# EAGLE design ai_aerial (EAGLE 6.5.0)
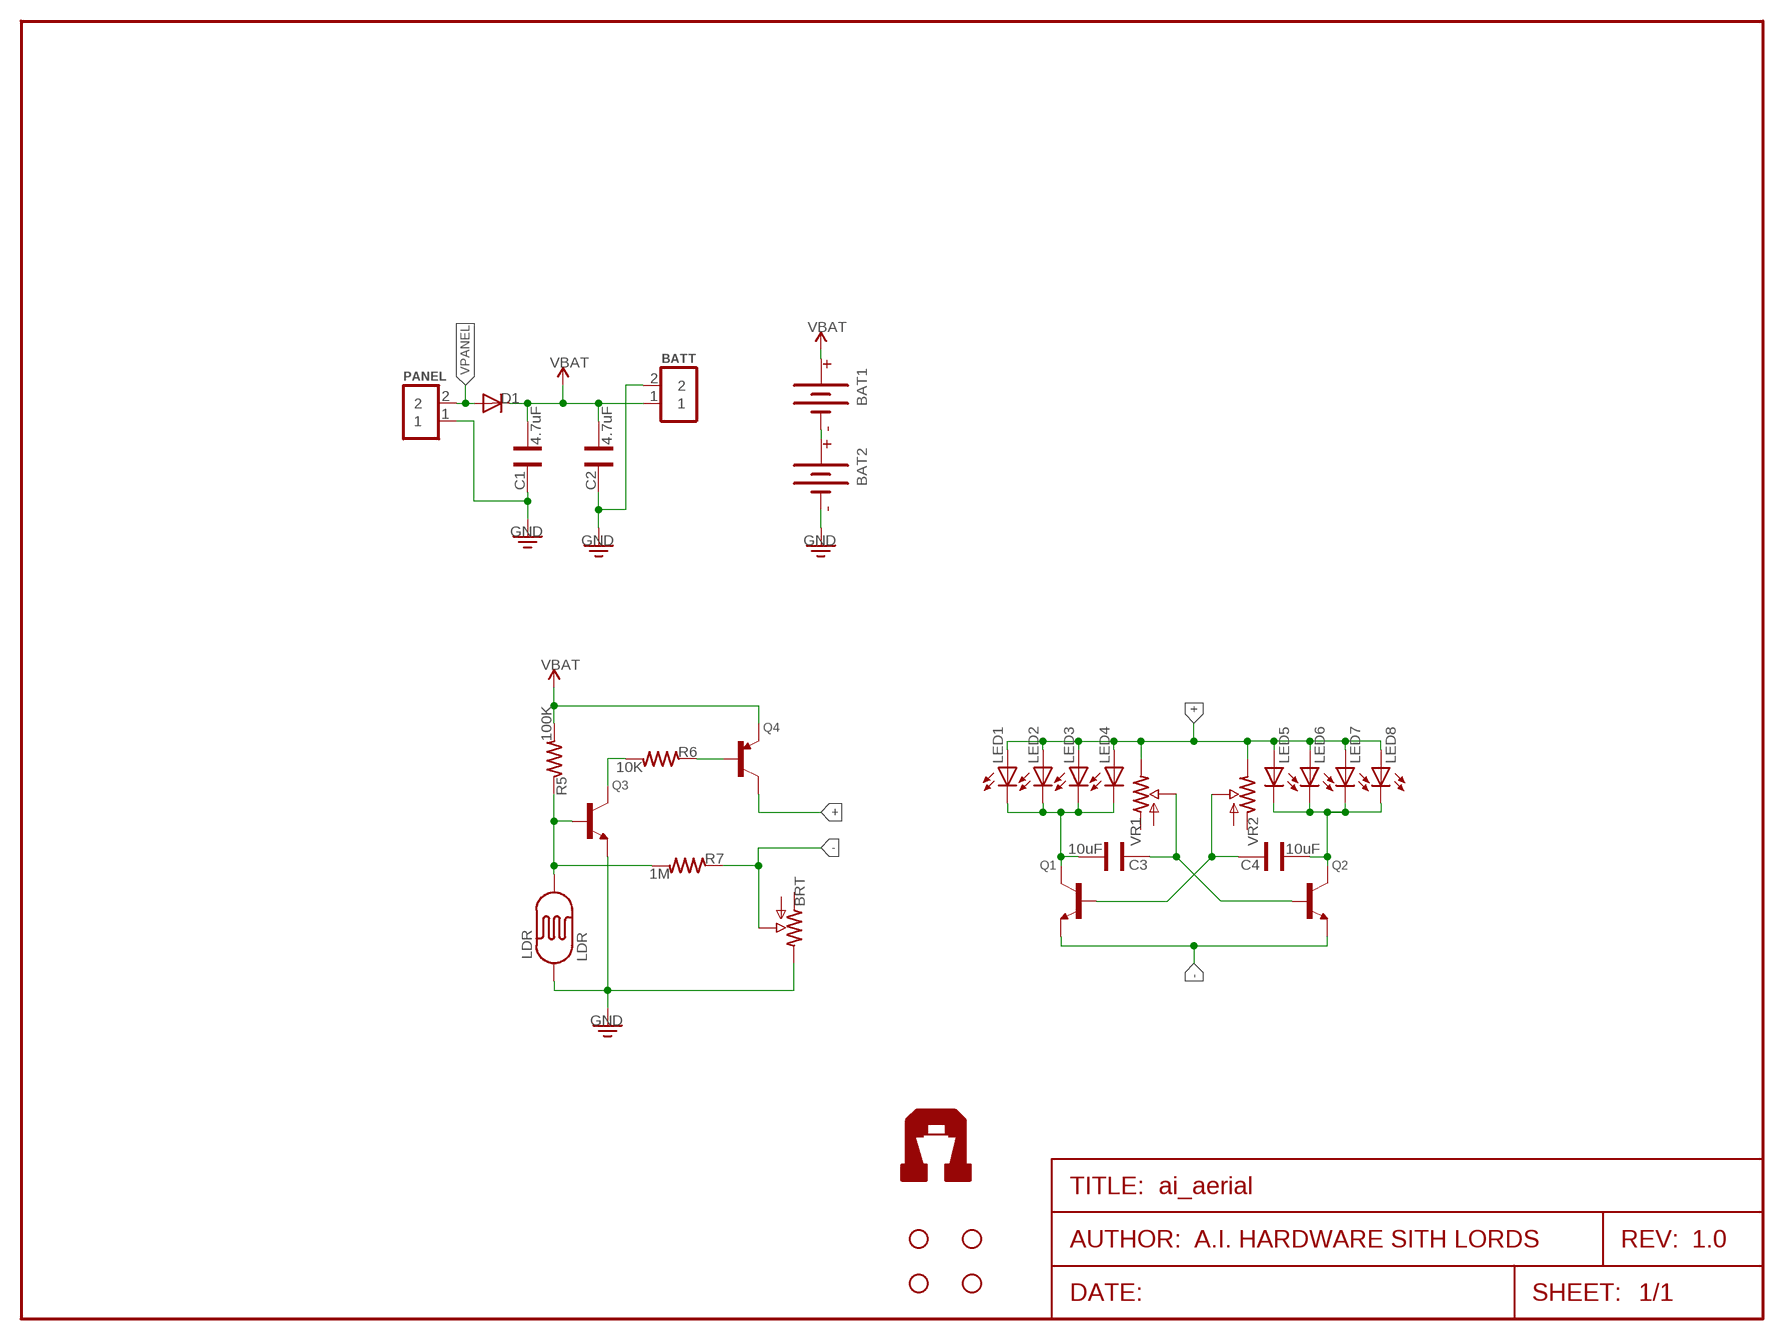
[diagram p0: schematic, sheet 1]
FRAME1 (FRAME-LETTER): AUTHOR: A.I. HARDWARE SITH LORDS; REV: 1.0

## Parts
BAT1  BATTERY-HOLDER  [BATTERY-AAA]
BAT2  BATTERY-HOLDER  [BATTERY-AAA]
BATT  1X02ST  [1X02-ST]
BRT  POT05X05  [POT-05X05]
C1  4.7uF  CAP025X050  [CAP-025X050]
C2  4.7uF  CAP025X050  [CAP-025X050]
C3  10uF  CAP025X050  [CAP-025X050]
C4  10uF  CAP025X050  [CAP-025X050]
D1  DIODETH-1N914  [TH-1N914]
LDR  LDR-PTH  [LDR]
LED1  LED5MM  [LED-5MM]
LED2  LED5MM  [LED-5MM]
LED3  LED5MM  [LED-5MM]
LED4  LED5MM  [LED-5MM]
LED5  LED5MM  [LED-5MM]
LED6  LED5MM  [LED-5MM]
LED7  LED5MM  [LED-5MM]
LED8  LED5MM  [LED-5MM]
PANEL  1X02ST  [1X02-ST]
Q1  TRANSISTOR-NPN  [TO-92-NPN]
Q2  TRANSISTOR-NPN  [TO-92-NPN]
Q3  TRANSISTOR-NPN  [TO-92-NPN]
Q4  TRANSISTOR-PNP  [TO-92-PNP]
R5  100K  RESAXIAL-0.4  [RES-AXIAL-0.4]
R6  10K  RESAXIAL-0.4  [RES-AXIAL-0.4]
R7  1M  RESAXIAL-0.4  [RES-AXIAL-0.4]
STANDOFF1  STAND-OFF  [STAND-OFF]
STANDOFF2  STAND-OFF  [STAND-OFF]
STANDOFF3  STAND-OFF  [STAND-OFF]
STANDOFF4  STAND-OFF  [STAND-OFF]
U$4  AI-LOGOM  [AI-LOGO-M]
VR1  POT05X05  [POT-05X05]
VR2  POT05X05  [POT-05X05]

## Nets
+: LED1.A LED2.A LED3.A LED4.A LED5.A LED6.A LED7.A LED8.A Q4.1(C) VR1.1(E) VR2.1(E)
-: BRT.2(S) Q1.1(E) Q2.1(E) R7.P$1
GND: BAT2.GND@1(-) BAT2.GND@2(-) BATT.2 BRT.1(E) C1.2 C2.2 LDR.1 PANEL.1 Q3.1(E)
N$1: BAT1.GND@1(-) BAT1.GND@2(-) BAT2.PWR@1(+) BAT2.PWR@2(+)
N$3: C4.1 LED5.C LED6.C LED7.C LED8.C Q2.3(C)
N$6: C3.2 Q2.2(B) VR1.2(S)
N$7: C4.2 Q1.2(B) VR2.2(S)
N$10: LDR.2 Q3.2(B) R5.P$1 R7.P$2
N$12: Q3.3(C) R6.P$2
N$13: Q4.2(B) R6.P$1
N$14: C3.1 LED1.C LED2.C LED3.C LED4.C Q1.3(C)
VBAT: BAT1.PWR@1(+) BAT1.PWR@2(+) BATT.1 C1.1 C2.1 D1.C Q4.3(E) R5.P$2
VPANEL: D1.A PANEL.2
Unconnected: BRT.3(A) VR1.3(A) VR2.3(A)

## Library data of the parts
BAT1 BAT2 = Ai_Electromechanical:BATTERY-HOLDER
BATT PANEL = Ai_Connectors:1X02
BRT VR1 VR2 = Ai_Passives:POT
C1-C4 = Ai_Passives:CAP
D1 = Ai_DiscreteSemis:DIODE
LDR = Ai_Sensors:LDR
LED1-LED8 = Ai_LED:LED
Q1-Q3 = Ai_DiscreteSemis:TRANSISTOR-NPN
Q4 = Ai_DiscreteSemis:TRANSISTOR-PNP
R5-R7 = Ai_Passives:RES: Part # blah Digikey
STANDOFF1-STANDOFF4 = Ai_Electromechanical:STAND-OFF: #4 Stand Off This is the mechanical footprint for a #4 phillips button head screw. Use the keepout ring to avoid running the screw head into surrounding components.
U$4 = Ai_Miscellany:AI-LOGO

## Board
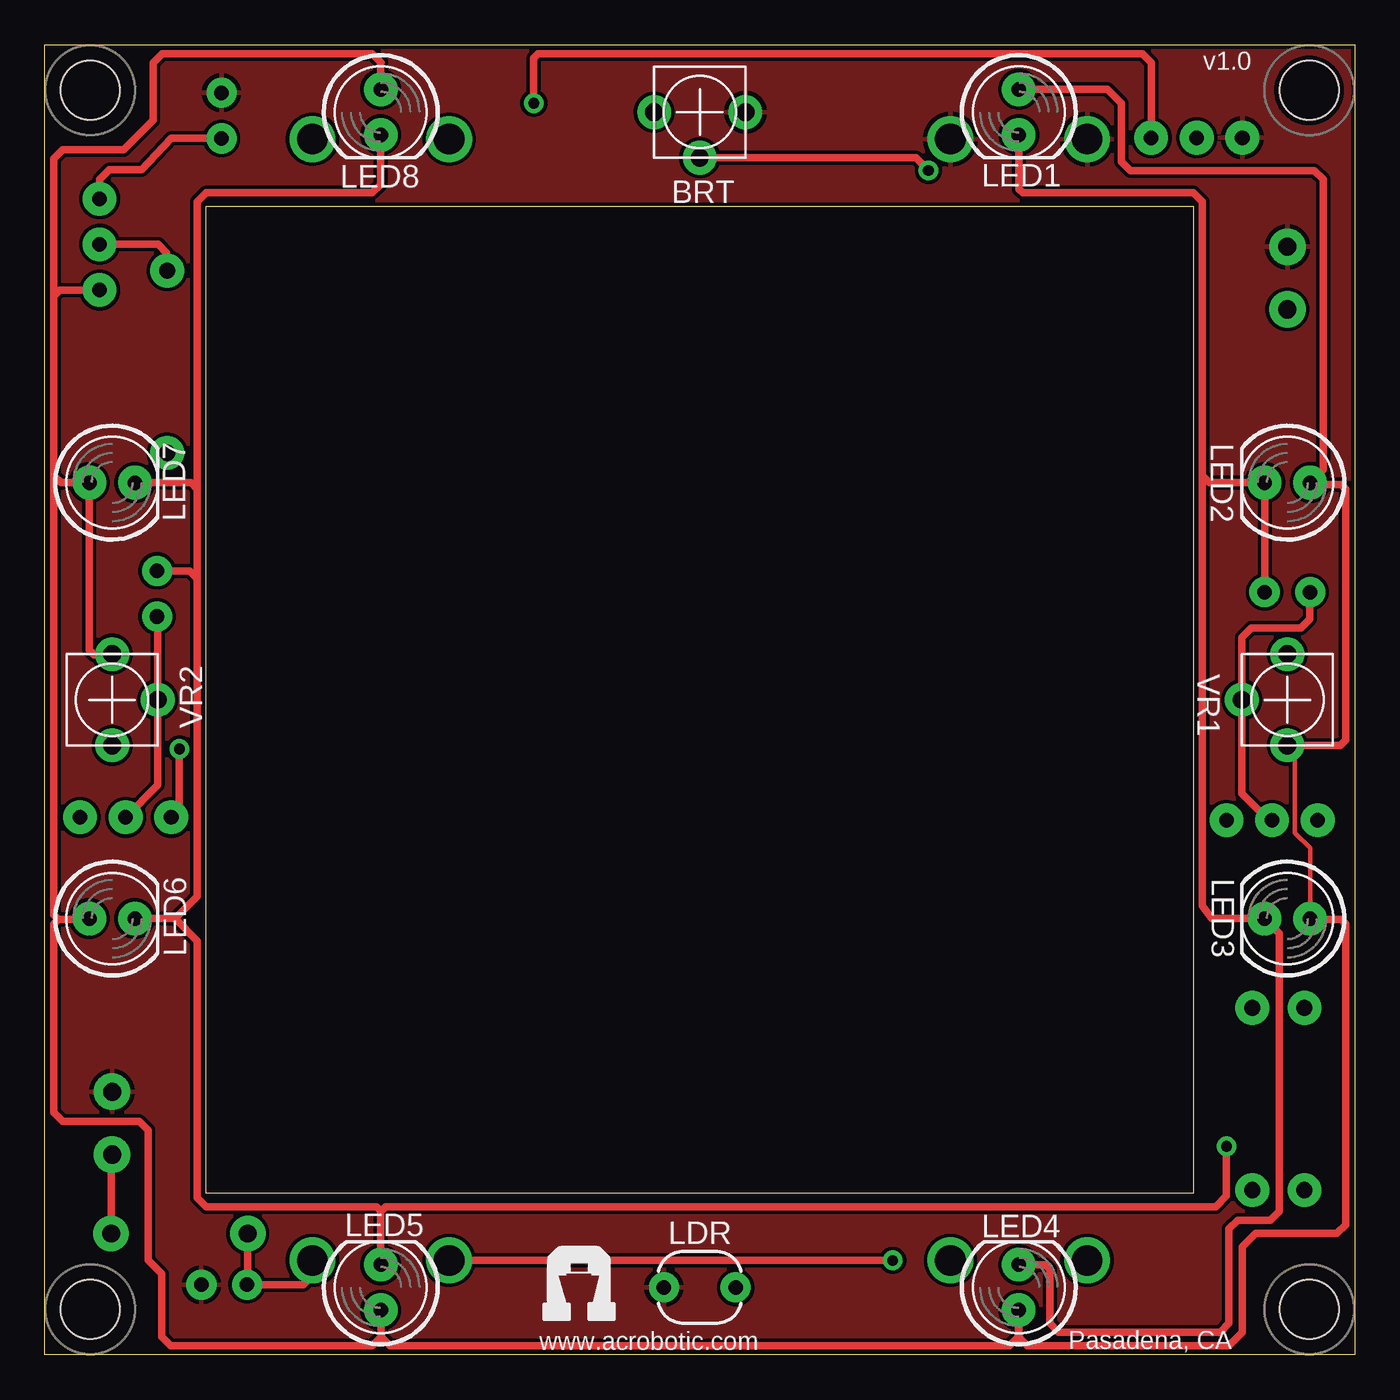
[diagram p1: board, top side]
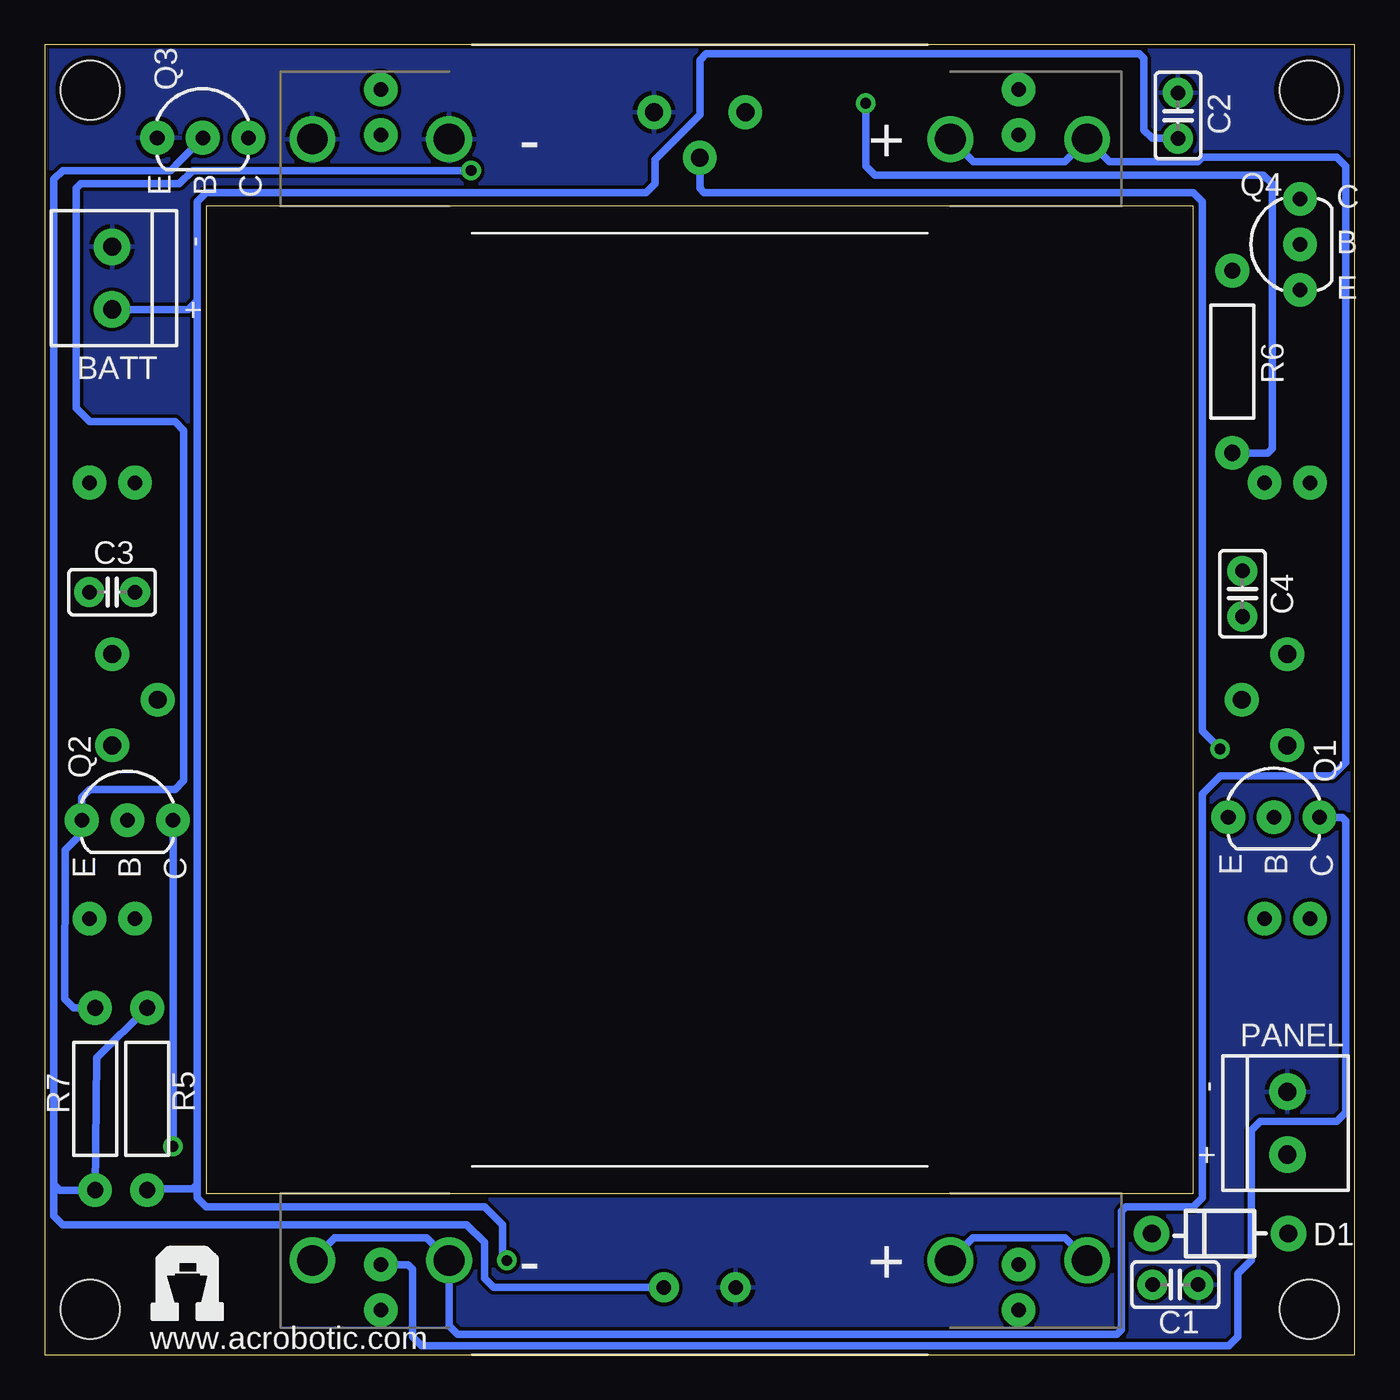
[diagram p2: board, bottom side, seen from below]

Size 73 x 73 mm. Coordinates in mm from the lower left corner, seen from the top.
Outline: 9,9 9,64 64,64 64,9 9,9
Outline: 0,0 0,73 73,73 73,0 0,0
Copper layers (1*16): Top 0.035mm / dielectric 1.5mm / Bottom 0.035mm
Design rules "ai_2layer": minimum track width 7mil, minimum drill 15mil, track to track 8mil, track to pad 8mil, pad to pad 8mil, via to via 8mil, smd to smd 8mil, copper to edge 8mil, drill to drill 8mil, minimum pad ring 12mil, minimum via ring 10mil, stop-mask expansion 4mil, vias tented up to drill 20mil, thermal gap 10mil

### Footprints (pad centres in the part's own frame; a part is rotated, then mirrored left to right if it is on the bottom)
BATTERY-AAA = drill 1.702: GND@1 21.59,0; GND@2 13.97,0; PWR@1 -21.59,0; PWR@2 -13.97,0
1X02-ST = drill 1.016 pad 2.032: 1 -1.75,0; 2 1.75,0
POT-05X05 = drill 1 pad 1.88: 1 -2.54,0; 2 0,2.54; 3 2.54,0
CAP-025X050 = drill 0.813 pad 1.676: 1 -1.27,0; 2 1.27,0
TH-1N914 = drill 1 pad 1.981: A -3.81,0; C 3.81,0
LDR = drill 0.8 pad 1.676: 1 -2,0; 2 2,0
LED-5MM = drill 0.813 pad 1.88: A -1.27,0; C 1.27,0
TO-92-NPN = drill 0.813 pad 1.88: 1 0,-2.54; 2 0,0; 3 0,2.54
TO-92-PNP = drill 0.813 pad 1.88: 1 0,2.54; 2 0,0; 3 0,-2.54
RES-AXIAL-0.4 = drill 0.9 pad 1.88: P$1 -5.08,0; P$2 5.08,0
STAND-OFF = hole 3.302: 0,0

### Placement (x,y rotation side)
BAT1  36.5,5.25 180 bottom
BAT2  36.5,67.75 180 bottom
BATT  69.25,60 90 bottom
BRT  36.5,69.25 180 top
C1  9.99,3.9 0 bottom
C2  9.85,69.06 90 bottom
C3  69.25,42.5 180 bottom
C4  6.25,42.41 270 bottom
D1  7.5,6.75 180 bottom
LDR  36.5,3.75 0 top
LED1  54.28,69.25 270 top
LED2  69.25,48.6 180 top
LED3  69.25,24.3 180 top
LED4  54.28,3.75 90 top
LED5  18.72,3.75 90 top
LED6  3.75,24.3 0 top
LED7  3.75,48.6 0 top
LED8  18.72,69.25 270 top
PANEL  3.75,12.9 270 bottom
Q1  4.5,29.95 270 bottom
Q2  68.4,29.78 270 bottom
Q3  64.2,67.82 270 bottom
Q4  3.05,61.88 180 bottom
R5  67.3,14.25 270 bottom
R6  6.82,55.34 270 bottom
R7  70.2,14.25 270 bottom
STANDOFF1  2.54,70.46 0 top
STANDOFF2  70.46,70.46 0 top
STANDOFF3  2.54,2.54 0 top
STANDOFF4  70.46,2.54 0 top
U$3  AI-LOGOM  [AI-LOGO-M]  27.64,1.78 0 top
U$4  67.19,1.78 0 bottom
VR1  69.25,36.5 90 top
VR2  3.75,36.5 270 top

### Tracks (layer width: path | path; a pad name or v marks a point on that pad's centre or on a via)
+
  Top 0.254: LED3.A 70.52,28.23 69.67,29.09 69.67,33.54 VR1.1
  Top 0.406: LED8.A 18.72,71.97 18.75,72 18.25,72.5 6.55,72.5 6.05,72 6.05,68.8 4.4,67.15 1,67.15 0.5,66.65 0.5,59 | 0.5,59 0.5,49 | 0.5,49 0.5,24.5 0.75,24.25 | 0.75,24.25 2.43,24.25 LED6.A | 0.5,49 0.9,48.6 LED7.A 2.48,39.27 2.75,39 3.71,39 VR2.1 | 18.75,1 18.25,0.5 7,0.5 6.5,1 6.5,4.5 5.75,5.25 5.75,12.5 5.25,13 1,13 0.5,13.5 0.5,24 0.75,24.25 | LED5.A 18.75,2.45 18.75,1 | 18.75,1 19.25,0.5 53.75,0.5 54.25,1 54.25,2.45 LED4.A 54.28,0.97 54.75,0.5 66,0.5 66.75,1.25 66.75,6 67.5,6.75 72,6.75 72.5,7.25 72.5,24 72.25,24.25 70.57,24.25 LED3.A | VR1.1 72.21,33.96 72.5,34.25 72.5,48.25 72.25,48.5 70.62,48.5 LED2.A 71.25,49.33 71.25,65.5 70.75,66 60.5,66 60,66.5 60,69.75 59.23,70.52 LED1.A | Q4.1 0.84,59.34 0.5,59
-  (via drill 0.6)
  Top 0.406: v49.25,66 48.54,66.71 BRT.2 | Q1.1 7.5,30.41 v7.5,33.75
  Bottom 0.406: v49.25,66 64.75,66 65.5,65.25 71,65.25 71.25,65 71.25,52.75 70.5,52 65.75,52 65.25,51.5 65.25,32 65.75,31.5 70.5,31.5 70.94,31.06 Q2.1 70.94,29.06 71.87,28.12 71.88,19.84 71.38,19.34 R7.P$1 | v7.5,33.75 8.5,34.75 8.5,64.25 9,64.75 36.25,64.75 36.5,65 BRT.2
GND
  pour Bottom: 0,0 0,73 73,73 73,0
  pour Top: 0,0 0,73 73,73 73,0
N$1
  Bottom 0.406: BAT2.PWR@2 22.5,67.75 21.25,66.5 16.16,66.5 BAT2.PWR@1 13.66,66.5 8.75,66.5 8.5,66.75 1,66.75 0.5,66.25 0.5,33 1.25,32.25 7.5,32.25 8.5,31.25 8.5,8.75 9,8.25 12.75,8.25 13,8 13,1.38 13.25,1.13 50.01,1.13 50.48,1.6 BAT1.GND@2 51.72,6.5 56.84,6.5 BAT1.GND@1
N$3  (via drill 0.6)
  Top 0.406: 8.5,48.25 8.5,64.25 9,64.75 18.25,64.75 18.72,65.22 LED8.C | 8.5,48.25 8.5,43.25 | 8.5,43.25 8.5,25.55 7.25,24.3 | LED5.C 18.72,8.03 | 18.72,8.03 18.5,8.25 9,8.25 8.5,8.75 8.5,23.05 7.25,24.3 | LED7.C 8.15,48.6 8.5,48.25 | 7.25,24.3 LED6.C | C4.1 8.07,43.68 8.5,43.25 | 18.72,8.03 18.78,8.03 19,8.25 65.25,8.25 65.86,8.86 v65.86,11.61
  Bottom 0.406: Q2.3 v65.86,11.61
N$6
  Top 0.406: C3.2 70.5,42.48 70.5,41 70,40.5 67.25,40.5 66.71,39.96 VR1.2 66.71,31.29 68.22,29.78 Q2.2
N$7
  Top 0.406: C4.2 6.29,41.1 VR2.2 6.29,31.74 Q1.2
N$10
  Bottom 0.406: Q3.2 65.45,66.55 66,66 72,66 72.5,65.5 72.5,9.5 | 72.5,9.5 72.17,9.17 R7.P$2 70.1,16.53 R5.P$1 | LDR.2 48,3.75 48.5,4.25 48.5,6.25 49.5,7.25 72,7.25 72.5,7.75 72.5,9.5
N$12  (via drill 0.6)
  Top 0.406: v27.25,69.75 27.25,72.25 27.5,72.5 61.16,72.5 61.66,72 Q3.3
  Bottom 0.406: v27.25,69.75 27.25,66.25 26.75,65.75 5.1,65.75 4.6,65.25 4.6,50.5 4.84,50.26 R6.P$2
N$13
  Top 0.406: Q4.2 6.32,61.88 6.8,61.4 6.8,60.44 R6.P$1
N$14
  Top 0.406: LED1.C 54.28,64.97 54.5,64.75 64,64.75 64.5,64.25 64.5,49 | 64.5,49 64.9,48.6 LED2.C C3.1 | 64.5,49 64.5,25 65.05,24.3 LED3.C 68.8,23.48 68.8,8 68.3,7.5 66.5,7.5 66,7 66,1.75 65.5,1.25 56.5,1.25 56,1.75 56,4.75 55.75,5 54.75,5 54.73,5.02 LED4.C
  Bottom 0.406: Q1.3 0.7,29.95 0.5,29.75 0.5,13.5 1,13 5.25,13 5.75,12.5 5.75,5.25 6.5,4.5 6.5,1 7,0.5 52,0.5 52.5,1 52.5,4.75 52.75,5 54.26,5 LED4.C
VBAT  (via drill 0.6)
  Top 0.406: D1.C 11.31,3.94 C1.1 14.4,3.9 14.75,4.25 14.75,5.09 BAT1.PWR@1 | Q4.3 3.05,65.5 3.6,66.05 5.4,66.05 7.04,67.78 C2.1 | BAT1.PWR@2 v47.25,5.25
  Bottom 0.406: C2.1 11.29,67.78 11.75,68.25 11.75,72.25 12,72.5 36.14,72.5 36.5,72.14 36.5,69.1 39,66.6 39,65.25 39.5,64.75 64,64.75 64.5,64.25 64.5,58.75 | BATT.1 65,58.25 64.5,58.75 | BAT1.PWR@2 21.28,6.5 16.16,6.5 BAT1.PWR@1 | 64.5,58.75 64.5,9.5 | 64.5,9.5 64.75,9.25 67.42,9.25 R5.P$2 | v47.25,5.25 47.5,5.5 47.5,7.25 48.5,8.25 64,8.25 64.5,8.75 64.5,9.5
VPANEL
  Top 0.406: D1.A 3.69,11.09 PANEL.2

### Text on the board
tNames: v1.0 | www.acrobotic.com | Pasadena, CA
bNames: - | + | - | + | www.acrobotic.com